# Altium schematic sheet CHARGING.SchDoc
size A4; SheetNumber: 6; SheetTotal: 7
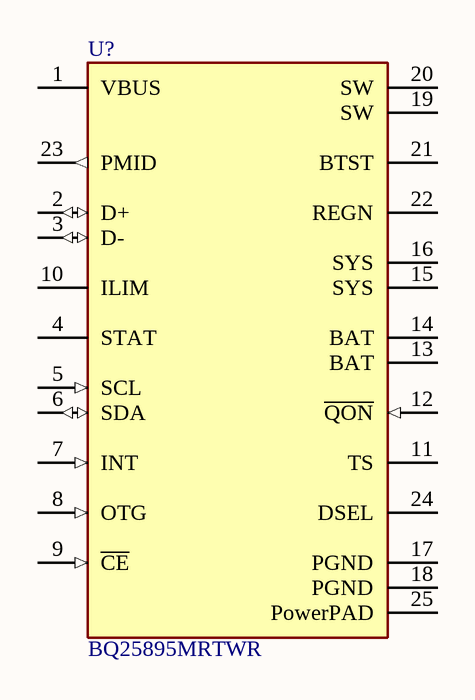
[diagram p0: CHARGING.SchDoc]

## Parts
U?  BQ25895MRTWR  [FP-RTW0024H-MFG]

## Nets

Not connected (* = marked no-connect by the designer): U? 1(VBUS) 2(D+) 3(D-) 4(STAT) 5(SCL) 6(SDA) 7(INT) 8(OTG) 9(~{CE}) 10(ILIM) 11(TS) 12(~{QON}) 13(BAT) 14(BAT) 15(SYS) 16(SYS) 17(PGND) 18(PGND) 19(SW) 20(SW) 21(BTST) 22(REGN) 23(PMID) 24(DSEL) 25(PowerPAD)

## Library data of the parts
U? = CMP-04911-000051-1: IC BATT CHG LI-ION 1CELL 24WQFN; Max Charge Current: 5A; Output Voltage: 5.5V; Interface: I2C; Number of Cells: 1; Fault Protection: Over Temperature; Max Supply Voltage: 14V; Max Operating Temperature: 85°C; Mount: Surface Mount; Contact Plating: Gold; Min Operating Temperature: -40°C; Output Current: 5A; RoHS Compliant: Yes; Lead Free: Lead Free; Packaging: Cut Tape; Number of Pins: 24